# Altium schematic sheet Sche_01.SchDoc
size A3; SheetNumber: 1; SheetTotal: 1
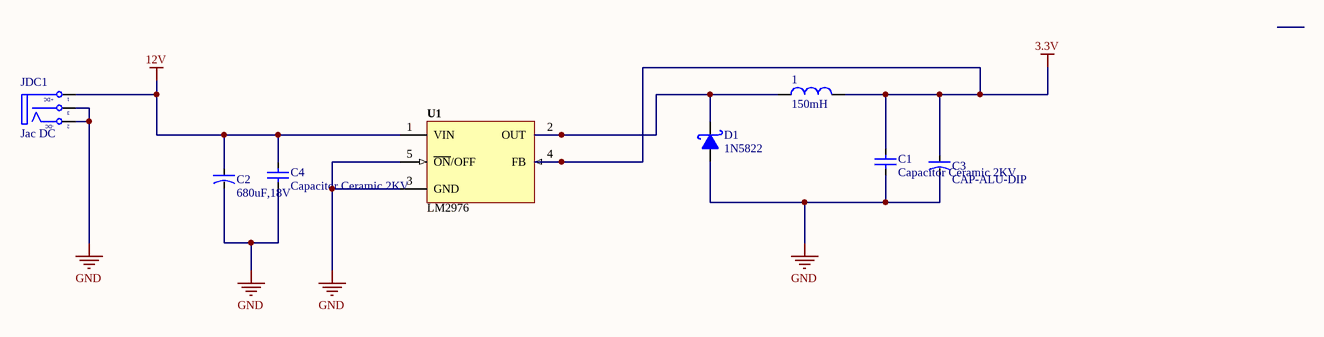
[diagram p0: Sche_01.SchDoc]

## Parts
1  150mH  [L-SMD-M-7.3x4.5]
C1  Capacitor Ceramic 2KV  [CAP_0805]
C2  680uF,18V  [CAP-ALU-SMD-4.5x5x1.4]
C3  CAP-ALU-DIP  [CA-ALU-2.54]
C4  Capacitor Ceramic 2KV  [CAP_0805]
D1  1N5822  [SMA]
JDC1  Jac DC  [DC-IN]
U1  LM2976  [VREG_LM2596S-ADJ/NOPB]

## Nets
3.3V: 1.2 C1.1 C3.1 U1.4(FB)
12V: C2.1 C4.2 JDC1.1(T) U1.1(VIN)
GND: C1.2 C2.2 C3.2 C4.1 D1.1(A) JDC1.2(TN) JDC1.3(S) U1.3(GND) U1.5(~{ON}/OFF)
Net1_1: 1.1 D1.2(K) U1.2(OUT)

## Notes on the sheet
- (in symbol DCIN) +DC; -DC

## Library data of the parts
1 = Inductor: Value: 150 mH
C1 C4 = Cap2KV: Published: 8-Jun-2000; LatestRevisionDate: 17-Jul-2002; LatestRevisionNote: Re-released for DXP Platform.; PackageReference: RAD-0.3; Publisher: Altium Limited
C2 C3 = CAP-ALU-DIP: Capacitor (Semiconductor SIM Model); Value: 104; LatestRevisionDate: 17-Jul-2002; LatestRevisionNote: Re-released for DXP Platform.; PackageReference: C1206; Publisher: Altium Limited
D1 = 1N5822: Schottky Rectifiers; Value: Diode c?m 1N5408
JDC1 = DCIN: Jac DC input; Value: Jac DC
U1 = LM2596: Max Input Voltage: 12 V; Max Output Current: 3 (6.0 peak) A; Max Output Voltage: mV; Category: IC-Power; Min Input Voltage: mV; Min Output Voltage: mV; Mounting Technology: Surface Mount; Status: Unreleased; Supply Voltage: mV; Temperature Range: -40 to +125 degC